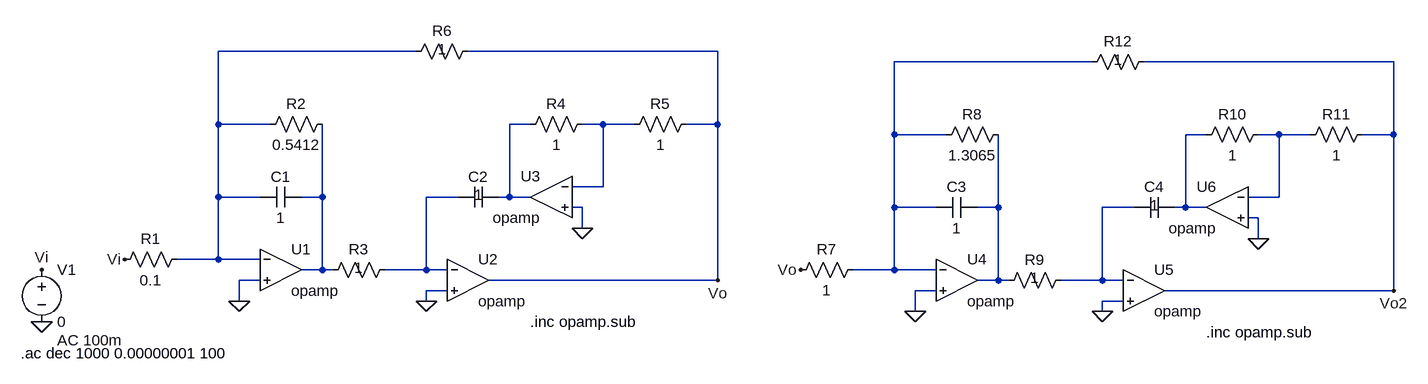
[diagram p0: schematic TS2.asc]
TS2.asc, the LTspice schematic file:
Version 4
SHEET 1 2316 680
WIRE 400 -192 96 -192
WIRE 864 -192 480 -192
WIRE 1440 -176 1136 -176
WIRE 1904 -176 1520 -176
WIRE 96 -80 96 -192
WIRE 176 -80 96 -80
WIRE 576 -80 544 -80
WIRE 688 -80 656 -80
WIRE 736 -80 688 -80
WIRE 864 -80 864 -192
WIRE 864 -80 816 -80
WIRE 1136 -64 1136 -176
WIRE 1216 -64 1136 -64
WIRE 1616 -64 1584 -64
WIRE 1728 -64 1696 -64
WIRE 1776 -64 1728 -64
WIRE 1904 -64 1904 -176
WIRE 1904 -64 1856 -64
WIRE 688 16 688 -80
WIRE 688 16 640 16
WIRE 96 32 96 -80
WIRE 160 32 96 32
WIRE 256 32 256 -80
WIRE 256 32 224 32
WIRE 464 32 416 32
WIRE 544 32 544 -80
WIRE 544 32 528 32
WIRE 576 32 544 32
WIRE 1728 32 1728 -64
WIRE 1728 32 1680 32
WIRE 656 48 640 48
WIRE 1136 48 1136 -64
WIRE 1200 48 1136 48
WIRE 1296 48 1296 -64
WIRE 1296 48 1264 48
WIRE 1504 48 1456 48
WIRE 1584 48 1584 -64
WIRE 1584 48 1568 48
WIRE 1616 48 1584 48
WIRE 1696 64 1680 64
WIRE 656 80 656 48
WIRE 1696 96 1696 64
WIRE 96 128 96 32
WIRE 96 128 32 128
WIRE 160 128 96 128
WIRE 256 144 256 32
WIRE 256 144 224 144
WIRE 272 144 256 144
WIRE 416 144 416 32
WIRE 416 144 352 144
WIRE 448 144 416 144
WIRE 1136 144 1136 48
WIRE 1136 144 1072 144
WIRE 1200 144 1136 144
WIRE 160 160 128 160
WIRE 864 160 864 -80
WIRE 864 160 512 160
WIRE 1296 160 1296 48
WIRE 1296 160 1264 160
WIRE 1312 160 1296 160
WIRE 1456 160 1456 48
WIRE 1456 160 1392 160
WIRE 1488 160 1456 160
WIRE 448 176 416 176
WIRE 1200 176 1168 176
WIRE 1904 176 1904 -64
WIRE 1904 176 1552 176
WIRE 128 192 128 160
WIRE 416 192 416 176
WIRE 1488 192 1456 192
WIRE 1168 208 1168 176
WIRE 1456 208 1456 192
FLAG 656 80 0
FLAG 416 192 0
FLAG 128 192 0
FLAG -48 128 Vi
FLAG 864 160 Vo
FLAG -176 224 0
FLAG -176 144 Vi
FLAG 1696 96 0
FLAG 1456 208 0
FLAG 1168 208 0
FLAG 992 144 Vo
FLAG 1904 176 Vo2
SYMBOL res 48 112 R90
WINDOW 0 0 56 VBottom 2
WINDOW 3 32 56 VTop 2
SYMATTR InstName R1
SYMATTR Value 0.1
SYMBOL res 272 -96 R90
WINDOW 0 0 56 VBottom 2
WINDOW 3 32 56 VTop 2
SYMATTR InstName R2
SYMATTR Value 0.5412
SYMBOL res 368 128 R90
WINDOW 0 0 56 VBottom 2
WINDOW 3 28 56 VBottom 2
SYMATTR InstName R3
SYMATTR Value 1
SYMBOL cap 224 16 R90
WINDOW 0 0 32 VBottom 2
WINDOW 3 32 32 VTop 2
SYMATTR InstName C1
SYMATTR Value 1
SYMBOL Opamps\\opamp 192 80 R0
SYMATTR InstName U1
SYMBOL Opamps\\opamp 480 96 R0
SYMATTR InstName U2
SYMBOL Opamps\\opamp 608 -32 M0
SYMATTR InstName U3
SYMBOL cap 528 16 R90
WINDOW 0 0 32 VBottom 2
WINDOW 3 28 32 VBottom 2
SYMATTR InstName C2
SYMATTR Value 1
SYMBOL res 672 -96 R90
WINDOW 0 0 56 VBottom 2
WINDOW 3 32 56 VTop 2
SYMATTR InstName R4
SYMATTR Value 1
SYMBOL res 832 -96 R90
WINDOW 0 0 56 VBottom 2
WINDOW 3 32 56 VTop 2
SYMATTR InstName R5
SYMATTR Value 1
SYMBOL res 496 -208 R90
WINDOW 0 0 56 VBottom 2
WINDOW 3 28 56 VBottom 2
SYMATTR InstName R6
SYMATTR Value 1
SYMBOL voltage -176 128 R0
WINDOW 123 24 124 Left 2
WINDOW 39 0 0 Left 2
SYMATTR Value2 AC 100m
SYMATTR InstName V1
SYMATTR Value 0
SYMBOL res 1088 128 R90
WINDOW 0 0 56 VBottom 2
WINDOW 3 32 56 VTop 2
SYMATTR InstName R7
SYMATTR Value 1
SYMBOL res 1312 -80 R90
WINDOW 0 0 56 VBottom 2
WINDOW 3 32 56 VTop 2
SYMATTR InstName R8
SYMATTR Value 1.3065
SYMBOL res 1408 144 R90
WINDOW 0 0 56 VBottom 2
WINDOW 3 28 56 VBottom 2
SYMATTR InstName R9
SYMATTR Value 1
SYMBOL cap 1264 32 R90
WINDOW 0 0 32 VBottom 2
WINDOW 3 32 32 VTop 2
SYMATTR InstName C3
SYMATTR Value 1
SYMBOL Opamps\\opamp 1232 96 R0
SYMATTR InstName U4
SYMBOL Opamps\\opamp 1520 112 R0
SYMATTR InstName U5
SYMBOL Opamps\\opamp 1648 -16 M0
SYMATTR InstName U6
SYMBOL cap 1568 32 R90
WINDOW 0 0 32 VBottom 2
WINDOW 3 28 32 VBottom 2
SYMATTR InstName C4
SYMATTR Value 1
SYMBOL res 1712 -80 R90
WINDOW 0 0 56 VBottom 2
WINDOW 3 32 56 VTop 2
SYMATTR InstName R10
SYMATTR Value 1
SYMBOL res 1872 -80 R90
WINDOW 0 0 56 VBottom 2
WINDOW 3 32 56 VTop 2
SYMATTR InstName R11
SYMATTR Value 1
SYMBOL res 1536 -192 R90
WINDOW 0 0 56 VBottom 2
WINDOW 3 28 56 VBottom 2
SYMATTR InstName R12
SYMATTR Value 1
TEXT -208 272 Left 2 !.ac dec 1000 0.00000001 100
TEXT 576 224 Left 2 !.inc opamp.sub
TEXT 1616 240 Left 2 !.inc opamp.sub

The netlist it stands for:
* TS2.asc
R1 N001 Vi 0.1
R2 N007 N001 0.5412
R3 N008 N007 1
C1 N007 N001 1
XU1 N001 0 N007 opamp Aol=100K GBW=10Meg  ; pins invin noninvin out
XU2 N008 0 Vo opamp Aol=100K GBW=10Meg  ; pins invin noninvin out
XU3 N004 0 N003 opamp Aol=100K GBW=10Meg  ; pins invin noninvin out
C2 N003 N008 1
R4 N004 N003 1
R5 Vo N004 1
R6 Vo N001 1
V1 Vi 0 0 AC 100m
R7 N002 Vo 1
R8 N009 N002 1.3065
R9 N010 N009 1
C3 N009 N002 1
XU4 N002 0 N009 opamp Aol=100K GBW=10Meg  ; pins invin noninvin out
XU5 N010 0 Vo2 opamp Aol=100K GBW=10Meg  ; pins invin noninvin out
XU6 N006 0 N005 opamp Aol=100K GBW=10Meg  ; pins invin noninvin out
C4 N005 N010 1
R10 N006 N005 1
R11 Vo2 N006 1
R12 Vo2 N002 1
.ac dec 1000 0.00000001 100
.inc opamp.sub
.inc opamp.sub
.backanno
.end